# EAGLE design ov7670 (EAGLE 8.4.1)
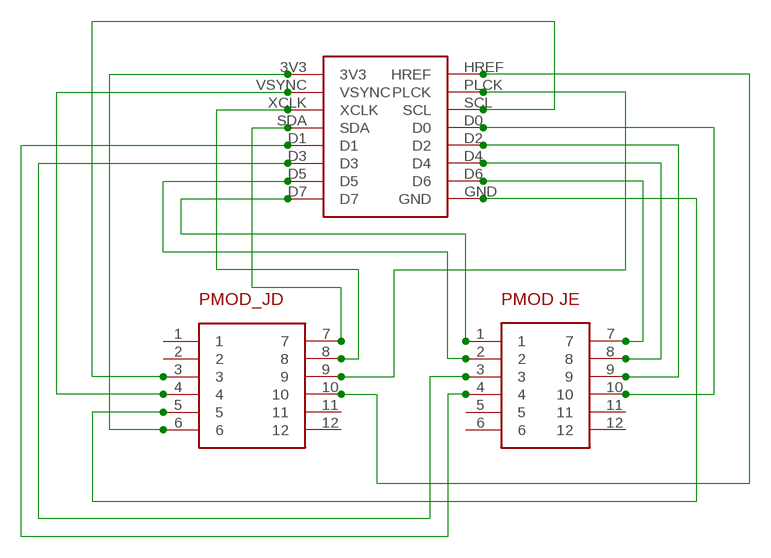
[diagram p0: schematic, sheet 1]

## Parts
U$1  OV7670  [OV7670]
U$2  PMOD_JD  [PMOD_JD]
U$3  PMOD_JE  [PMOD_JE]

## Nets
3V3: U$1.3V3 U$2.6
D0: U$1.D0 U$3.10
D1: U$1.D1 U$3.4
D2: U$1.D2 U$3.9
D3: U$1.D3 U$3.3
D4: U$1.D4 U$3.8
D5: U$1.D5 U$3.2
D6: U$1.D6 U$3.7
D7: U$1.D7 U$3.1
GND: U$1.GND U$2.5
HREF: U$1.HREF U$2.10
PLCK: U$1.PLCK U$2.9
SCL: U$1.SCL U$2.3
SDA: U$1.SDA U$2.7
VSYNC: U$1.VSYNC U$2.4
XCLK: U$1.XCLK U$2.8
Unconnected: U$2.1 U$2.2 U$2.11 U$2.12 U$3.5 U$3.6 U$3.11 U$3.12

## Library data of the parts
U$1 = ov7670:OV7670
U$2 = ov7670:PMOD_JD
U$3 = ov7670:PMOD_JE

## Board
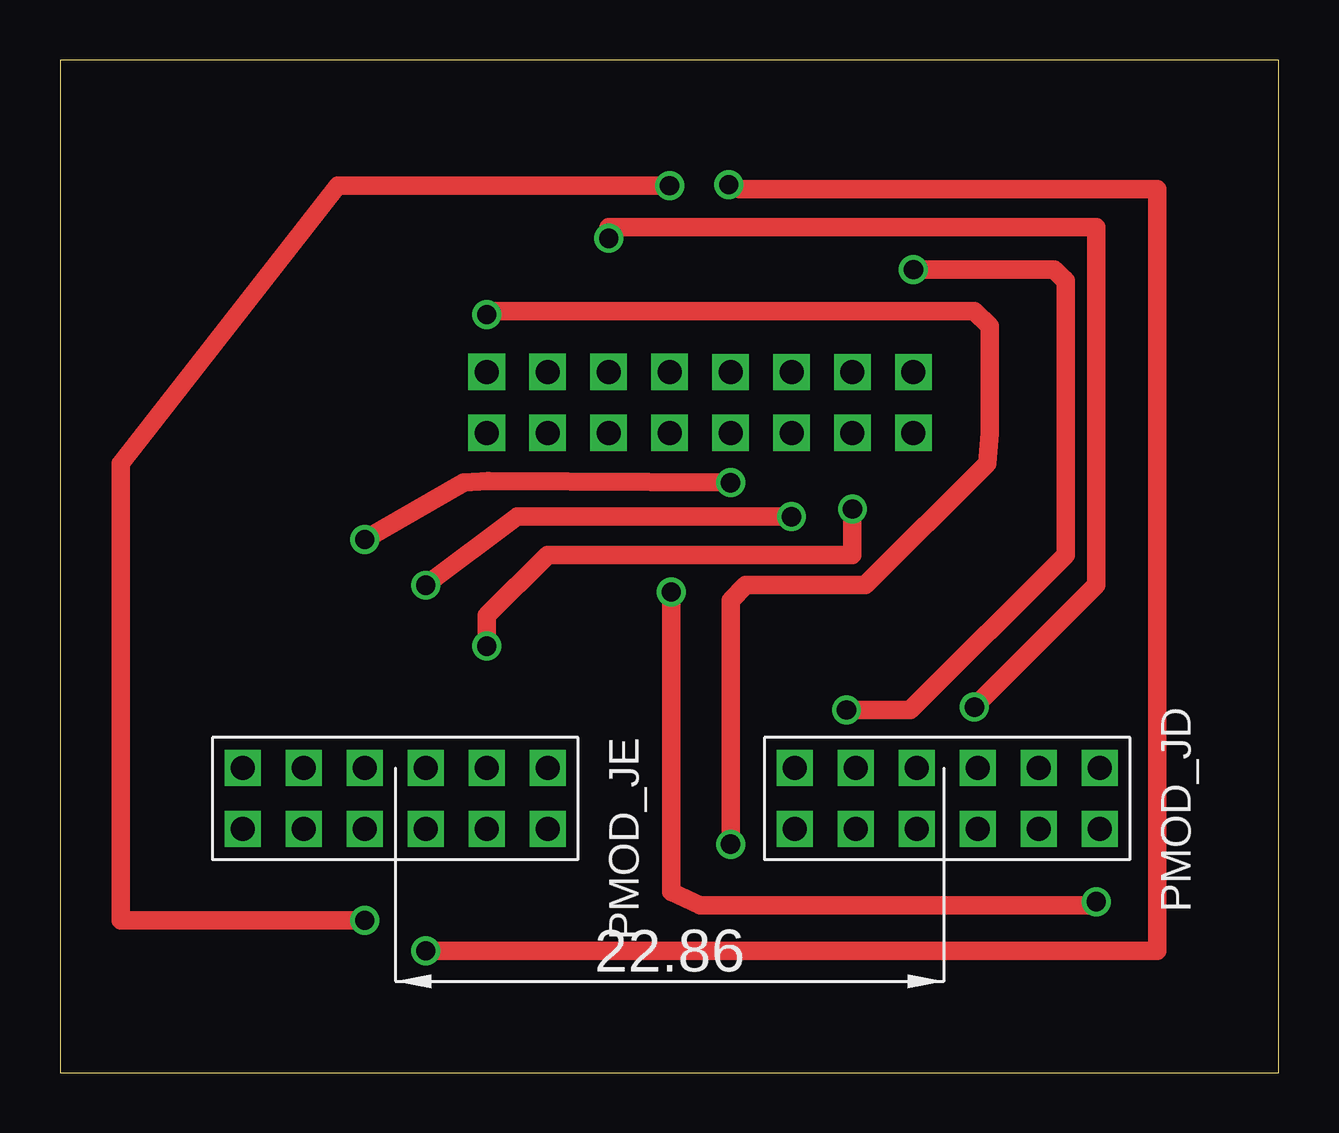
[diagram p1: board, top side]
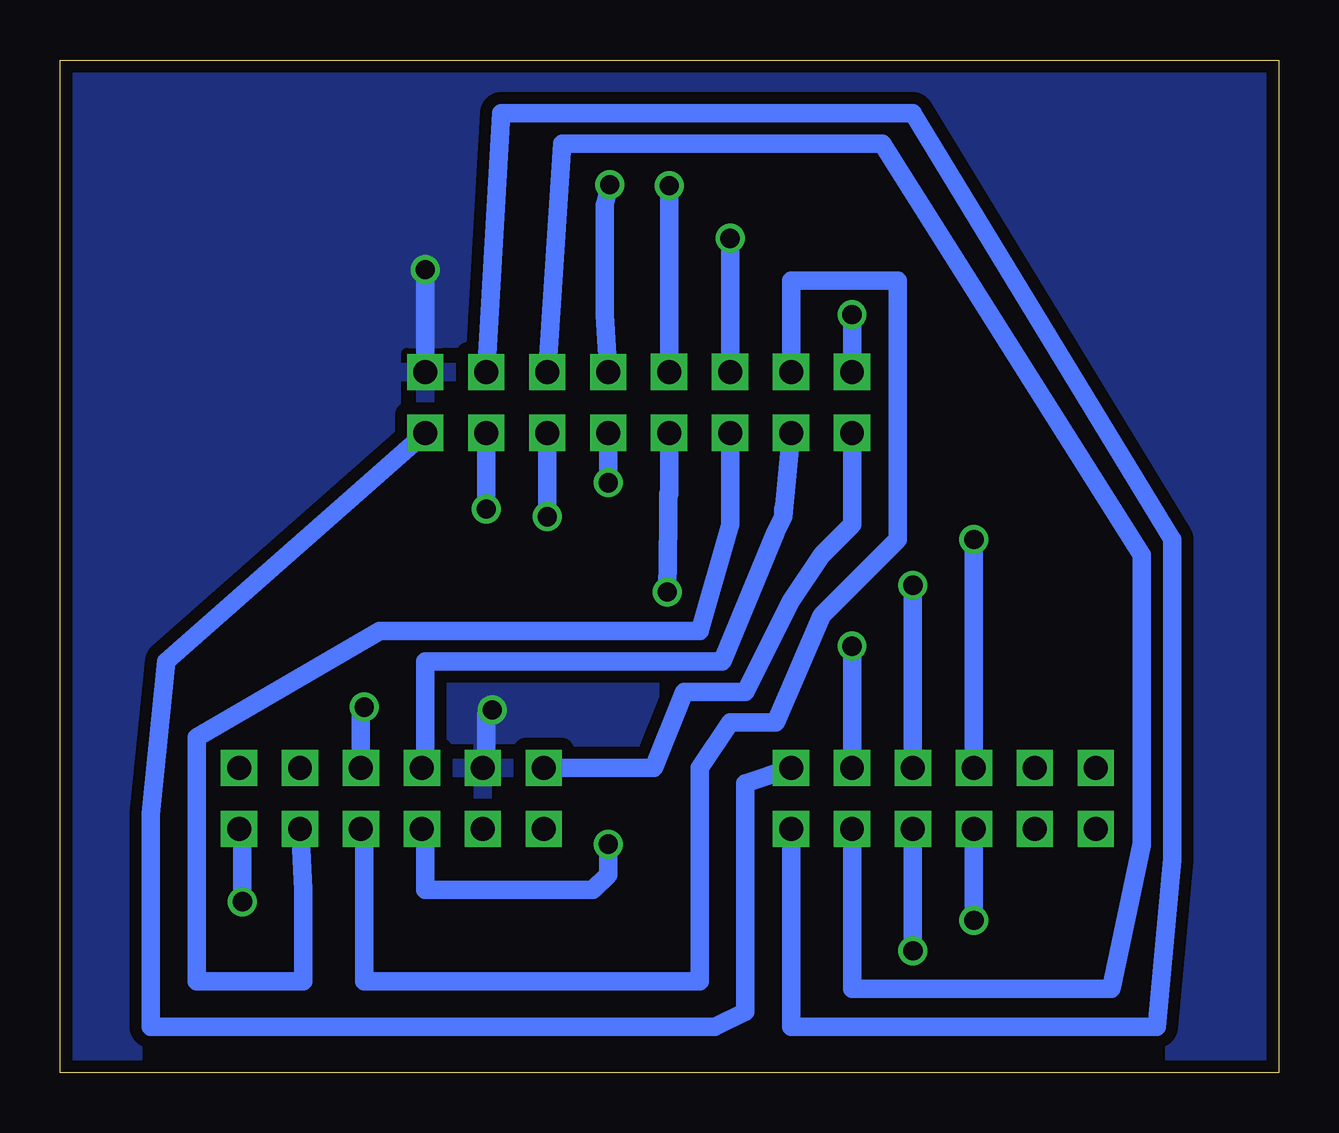
[diagram p2: board, bottom side, seen from below]

Size 50.78 x 42.22 mm. Coordinates in mm from the lower left corner, seen from the top.
Outline: 0,0 50.78,0 50.78,42.22 0,42.22 0,0
Copper layers (1*16): Top 0.035mm / dielectric 1.5mm / Bottom 0.035mm
Design rules "default *": minimum track width 30mil, minimum drill 0.35mm, track to track 20mil, track to pad 20mil, pad to pad 20mil, via to via 20mil, smd to smd 20mil, copper to edge 20mil, drill to drill 6mil, minimum pad ring 10mil, minimum via ring 8mil, stop-mask expansion 4mil, vias tented up to drill 0mil, thermal gap 10mil

### Footprints (pad centres in the part's own frame; a part is rotated, then mirrored left to right if it is on the bottom)
OV7670 = drill 1 pad 1.524 square: 3V3 -2.54,7.62; D0 0,0; HREF 0,7.62; PLCK 0,5.08; SCL 0,2.54; SDA -2.54,0; VSYNC -2.54,5.08; XCLK -2.54,2.54 | drill 1 square: D1 -2.54,-2.54; D2 0,-2.54; D3 -2.54,-5.08; D4 0,-5.08; D5 -2.54,-7.62; D6 0,-7.62; D7 -2.54,-10.16; GND 0,-10.16
PMOD_JD = drill 1 square: 1 -3.81,6.35; 2 -3.81,3.81; 3 -3.81,1.27; 4 -3.81,-1.27; 5 -3.81,-3.81; 6 -3.81,-6.35; 7 -1.27,6.35; 8 -1.27,3.81; 9 -1.27,1.27; 10 -1.27,-1.27; 11 -1.27,-3.81; 12 -1.27,-6.35
PMOD_JE = drill 1 square: 1 0,6.35; 2 0,3.81; 3 0,1.27; 4 0,-1.27; 5 0,-3.81; 6 0,-6.35; 7 2.54,6.35; 8 2.54,3.81; 9 2.54,1.27; 10 2.54,-1.27; 11 2.54,-3.81; 12 2.54,-6.35

### Placement (x,y rotation side)
U$1  25.4,29.21 90 top
U$2  36.97,8.89 270 top
U$3  13.97,12.7 270 top

### Tracks (layer width: path | path; a pad name or v marks a point on that pad's centre or on a via)
3V3
  Bottom 0.762: U$2.6 26.04,12.7 24.77,15.88 22.23,15.88 20.32,19.68 19.05,21.59 17.78,22.86 U$1.3V3
D0  (via drill 0.8 pad 1.05)
  Top 0.762: v25.4,36.97 11.57,36.97 2.54,25.4 2.54,6.35 v12.7,6.35
  Bottom 0.762: U$1.D0 v25.4,36.97 | U$3.10 v12.7,6.35
D1  (via drill 0.8 pad 0.8, 0.8 pad 1.05)
  Top 0.762: v27.94,24.59 17.85,24.66 16.83,24.59 v12.7,22.23
  Bottom 0.762: U$1.D1 v27.94,24.59 | v12.7,22.23 U$3.4
D2  (via drill 0.8 pad 1.05)
  Top 0.762: v15.24,5.08 45.72,5.08 45.72,36.83 28.32,36.83 v27.87,37.02
  Bottom 0.762: U$3.9 v15.24,5.08 | U$1.D2 28.08,31.61 28.08,36.17 v27.87,37.02
D3  (via drill 0.8 pad 1, 0.8 pad 1.05)
  Top 0.762: v15.24,20.32 19.05,23.18 v30.48,23.18
  Bottom 0.762: U$3.3 v15.24,20.32 | v30.48,23.18 U$1.D3
D4
  Bottom 0.762: U$3.8 17.78,3.49 6.99,3.49 5.71,9.53 5.71,21.59 16.51,38.73 29.84,38.73 U$1.D4
D5  (via drill 0.8 pad 1.05)
  Top 0.762: v17.78,17.78 17.78,19.05 20.32,21.59 33.02,21.59 v33.02,23.5
  Bottom 0.762: U$1.D5 v33.02,23.5 | U$3.2 v17.78,17.78
D6
  Bottom 0.762: U$3.7 20.32,1.91 5.08,1.91 4.45,8.89 4.45,22.23 15.24,40.01 32.38,40.01 U$1.D6
D7
  Bottom 0.762: U$3.1 22.23,12.06 22.23,2.54 23.5,1.91 46.99,1.91 46.99,10.79 46.35,17.14 U$1.D7
GND  (via drill 0.8 pad 1.05)
  Top 0.762: v32.77,15.12 35.44,15.12 41.91,21.59 41.91,33.02 41.74,33.16 41.42,33.48 v35.56,33.48
  Bottom 0.762: U$2.5 33.02,12.84 33.02,14.94 32.9,15.18 32.84,15.18 v32.77,15.12 | v35.56,33.48 U$1.GND
  pour Bottom: 0,0 50.8,0 50.8,41.91 0,41.91
HREF  (via drill 0.8 pad 0.8, 0.8 pad 1.05)
  Top 0.762: v27.94,9.53 27.94,19.68 28.57,20.32 33.55,20.32 38.63,25.4 38.73,26.67 38.73,31.11 38.1,31.75 17.78,31.75 v17.78,31.61
  Bottom 0.762: U$2.10 35.56,10.02 35.56,7.62 28.57,7.62 27.94,8.26 v27.94,9.53 | v17.78,31.61 U$1.HREF
PLCK
  Bottom 0.762: U$1.PLCK 20.32,33.02 15.88,33.02 15.88,22.23 19.05,19.05 20.95,14.61 22.86,14.61 24.13,12.7 24.13,3.81 38.1,3.81 38.1,10.16 U$2.9
SCL  (via drill 0.8 pad 1.05)
  Top 0.762: v38.1,15.24 43.18,20.32 43.18,35.24 22.86,35.24 v22.86,34.78
  Bottom 0.762: U$2.3 38.24,15.1 v38.1,15.24 | v22.86,34.78 U$1.SCL
SDA  (via drill 0.8 pad 1.05)
  Top 0.762: v25.47,20.03 25.47,7.55 26.67,6.99 43.18,6.99 v43.18,7.13
  Bottom 0.762: U$1.SDA 25.4,24.13 25.44,24.13 25.44,22.92 v25.47,20.03 | v43.18,7.13 43.18,10.02 U$2.7
VSYNC
  Bottom 0.762: 20.64,23.18 20.64,23.5 | 20.64,23.18 20.95,22.54 23.18,17.14 35.56,17.14 35.56,12.7 U$2.4 | U$1.VSYNC 20.64,23.18
XCLK
  Bottom 0.762: U$1.XCLK 22.86,22.86 24.13,18.41 37.47,18.41 45.09,13.97 45.09,3.81 40.64,3.81 40.64,7.62 U$2.8